# EAGLE design esp8266-programmer (EAGLE 7.6.0)
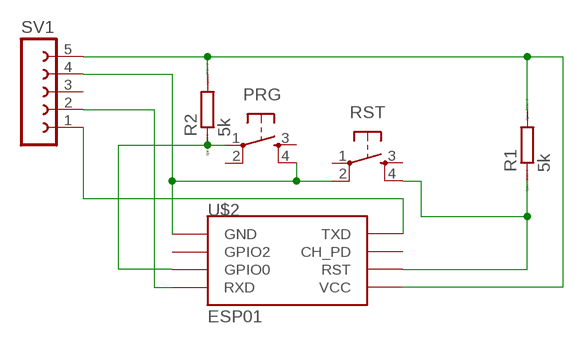
[diagram p0: schematic, sheet 1]

## Parts
PRG  TAC_SWITCHPTH  [TACTILE-PTH]
R1  5k  R0207/10  [0207/10]
R2  5k  R0207/10  [0207/10]
RST  TAC_SWITCHPTH  [TACTILE-PTH]
SV1  FE05W  [FE05W]
U$2  ESP01  [ESP01]

## Nets
3V3: R1.2 R2.2 SV1.5 U$2.VCC
GND: PRG.4 RST.2 SV1.4 U$2.GND
GPIO0: PRG.1 R2.1 U$2.GPIO0
RST: R1.1 RST.4 U$2.RST
RX-TX: SV1.1 U$2.TX(TXD)
TX-RX: SV1.2 U$2.RX(RXD)
Unconnected: PRG.2 PRG.3 RST.1 RST.3 SV1.3 U$2.CH_PD U$2.GPIO2

## Library data of the parts
PRG RST = SparkFun-Retired:TAC_SWITCH: Momentary Switch Button commonly used for reset or general input. Spark Fun Electronics SKU : COM-00097 SMT- SWCH-08247
R1 R2 = eagle-ltspice:R: RESISTOR, European symbol; SPICEMODEL: NONE; SPICEPREFIX: R
SV1 = con-lsta:FE05W: FEMALE HEADER; OC_FARNELL: unknown; OC_NEWARK: unknown
U$2 = esp8266modules:ESP01: ESP8266 Wifi module 01

## Net classes
0 GND: width 0.051 mm, drill 0.025 mm, clearance 0.038 mm

## Board
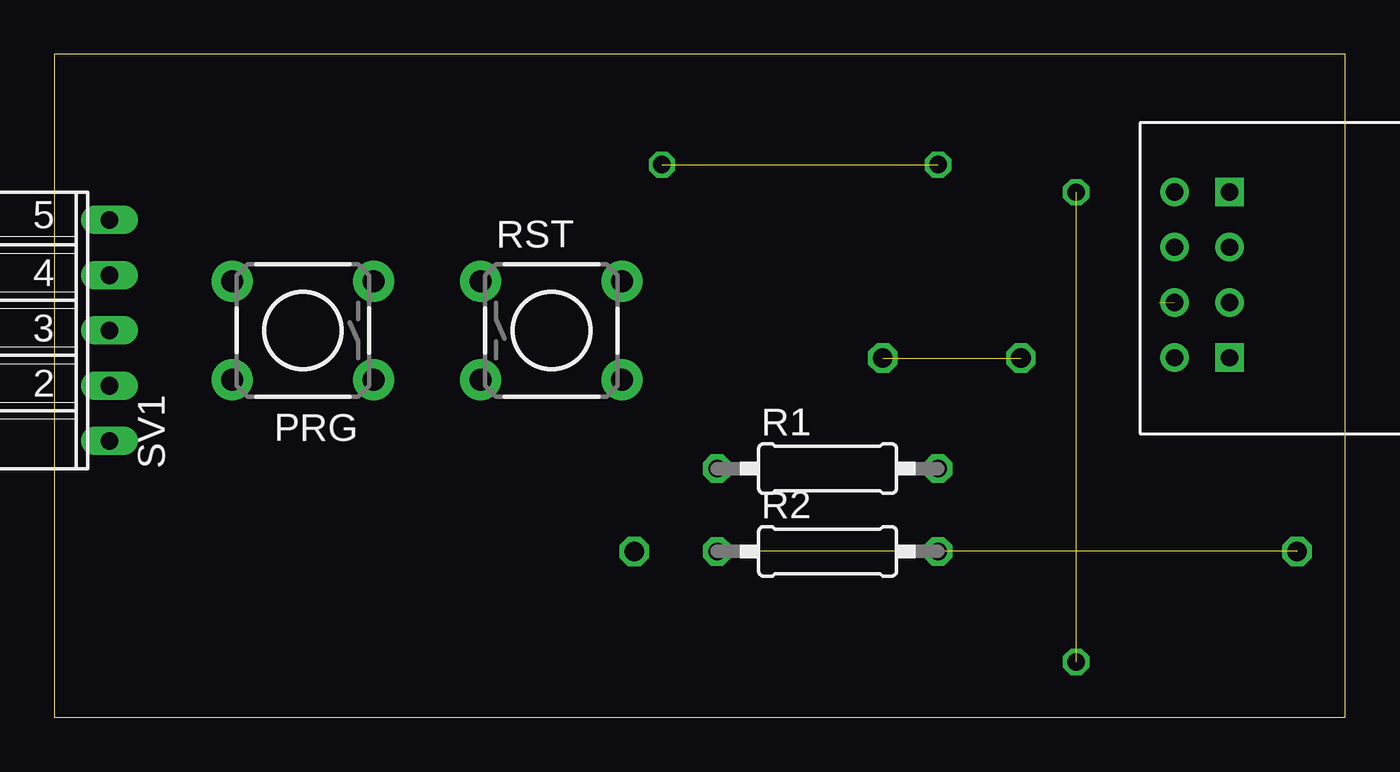
[diagram p1: board, top side]
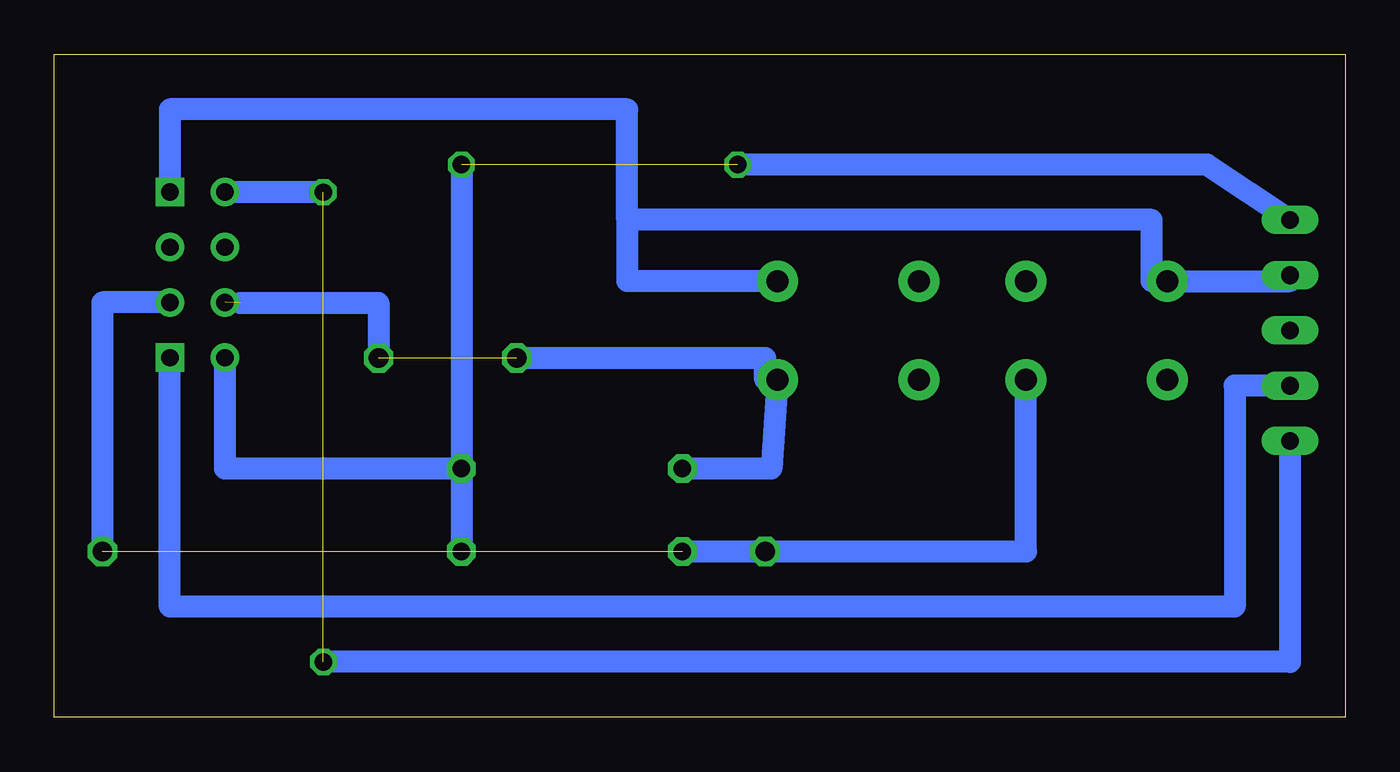
[diagram p2: board, bottom side, seen from below]

Size 59.36 x 30.47 mm. Coordinates in mm from the lower left corner, seen from the top.
Outline: 0,0 59.36,0 59.36,30.47 0,30.47 0,0
Copper layers (1*16): Top 0.035mm / dielectric 1.5mm / Bottom 0.035mm
Design rules "default": minimum track width 10mil, minimum drill 24mil, track to track 8mil, track to pad 8mil, pad to pad 8mil, via to via 8mil, smd to smd 8mil, copper to edge 40mil, drill to drill 8mil, minimum pad ring 10mil, minimum via ring 8mil, stop-mask expansion 4mil, vias tented up to drill 0mil, thermal gap 10mil

### Footprints (pad centres in the part's own frame; a part is rotated, then mirrored left to right if it is on the bottom)
TACTILE-PTH = drill 1.016 pad 1.88: 1 -3.251,2.261; 2 3.251,2.261; 3 -3.251,-2.261; 4 3.251,-2.261
0207/10 = drill 0.813 octagon: 1 -5.08,0; 2 5.08,0
FE05W = drill 0.813 long: 1 -5.08,0; 2 -2.54,0; 3 0,0; 4 2.54,0; 5 5.08,0
ESP01 = drill 0.8: CH_PD -1.285,-8.178; GPIO0 1.255,-5.638; GPIO2 -1.285,-5.638; RST 1.255,-8.178; TX -3.825,-8.178; VCC 3.795,-8.178 | drill 0.8 square: GND -3.825,-5.638; RX 3.795,-5.638

### Placement (x,y rotation side)
PRG  11.43,17.78 180 top
R1  35.56,11.43 0 top
R2  35.56,7.62 0 top
RST  22.86,17.78 0 top
SV1  2.54,17.78 90 top
U$2  59.69,20.32 270 top

### Tracks (layer width: path | path; a pad name or v marks a point on that pad's centre or on a via)
3V3  (via drill 0.8)  (1 unrouted)
  Bottom 1.016: R1.2 51.51,11.43 U$2.VCC | SV1.5 6.35,25.4 v27.94,25.4 | v40.64,25.4 R1.2 | R1.2 R2.2
  other vias: 40.64,11.43
GND
  Bottom 1.016: SV1.4 2.54,20.04 PRG.4 8.89,20.04 8.89,22.86 33.02,22.86 | RST.2 33.02,20.04 33.02,22.86 | 33.02,22.86 33.02,27.94 54.05,27.94 U$2.GND
GPIO0  (1 unrouted)
  Bottom 1.016: R2.1 14.68,7.62 PRG.1 | U$2.GPIO0 57.15,19.07 57.15,7.62
N$1  (via drill 0.9)
  other vias: 57.15,7.62
N$2  (via drill 0.9)
  other vias: 26.67,7.62
RST  (via drill 0.9)  (2 unrouted)
  Bottom 1.016: R1.1 26.39,11.43 RST.4 26.67,15.52 26.67,16.51 v38.1,16.51 | 50.8,19.05 44.45,19.05 v44.45,16.51
RX-TX  (via drill 0.8)  (1 unrouted)
  Bottom 0.406: 46.99,24.15 v46.99,24.13
  Bottom 1.016: SV1.1 2.54,2.54 v46.99,2.54 | U$2.TX 46.99,24.15
TX-RX
  Bottom 1.016: SV1.2 5.08,15.24 5.08,5.08 54.05,5.08 U$2.RX